# Altium schematic sheet 0204_PCH_MISC.SchDoc
size A3
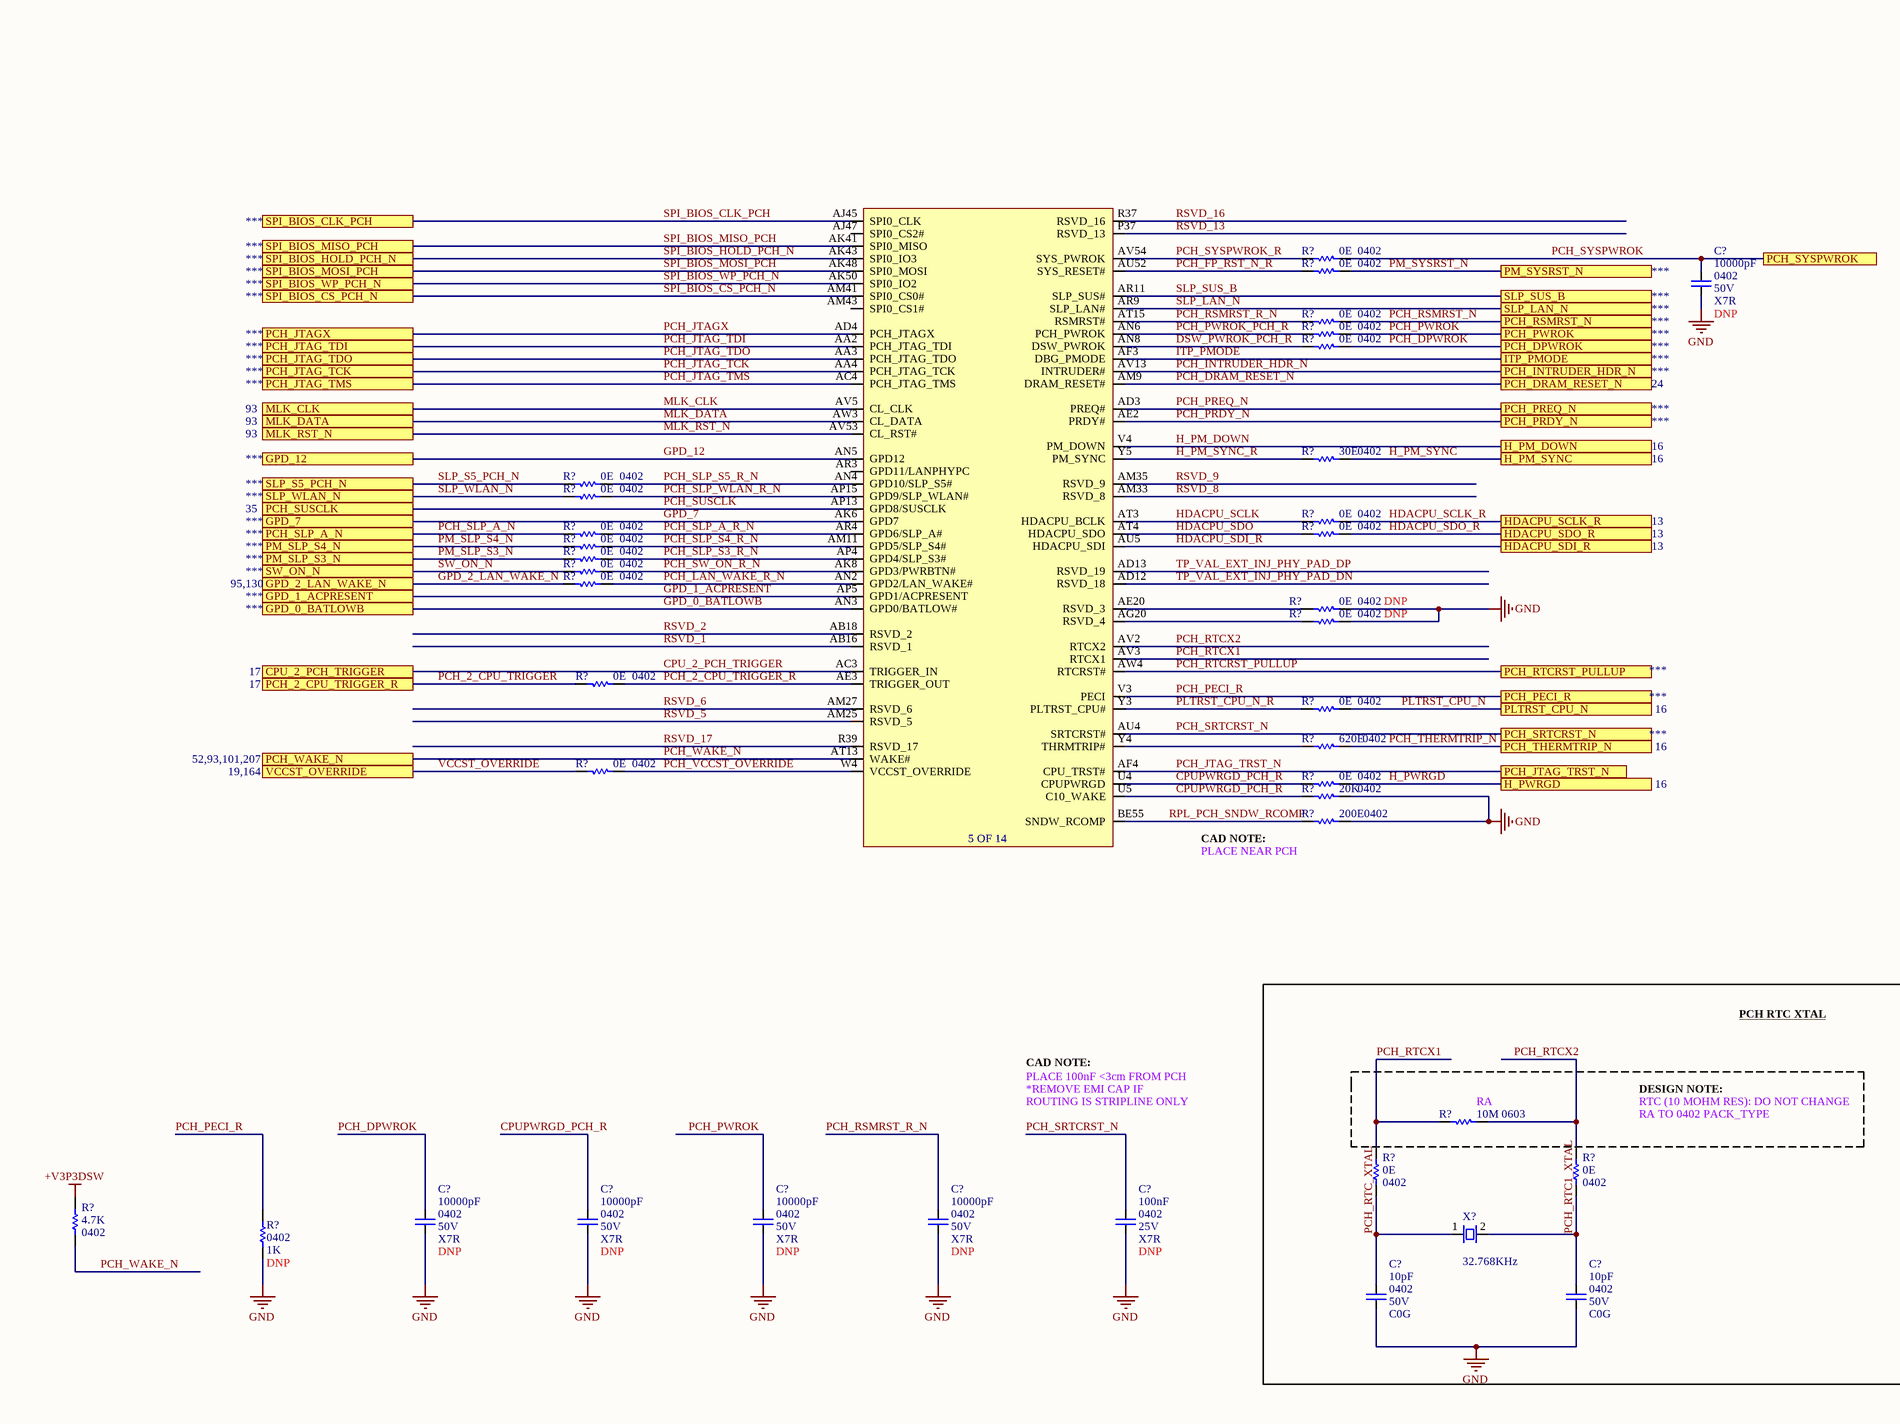
[diagram p0: 0204_PCH_MISC.SchDoc, left]
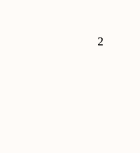
[diagram p1: 0204_PCH_MISC.SchDoc, right]

## Parts
(Parts that share a designator on the sheet are numbered #1, #2 ... from top to bottom, then left to right.)
C?#1  value 10000pF  Case/Package: 0402  Voltage: 50V  Dielectric: X7R  [CAPC0402]
C?#2  value 10000pF  Case/Package: 0402  Voltage: 50V  Dielectric: X7R  [CAPC0402]
C?#3  value 10000pF  Case/Package: 0402  Voltage: 50V  Dielectric: X7R  [CAPC0402]
C?#4  value 10000pF  Case/Package: 0402  Voltage: 50V  Dielectric: X7R  [CAPC0402]
C?#5  value 10000pF  Case/Package: 0402  Voltage: 50V  Dielectric: X7R  [CAPC0402]
C?#6  value 100nF  Case/Package: 0402  Voltage: 25V  Dielectric: X7R  [CAPC0402]
C?#7  value 10pF  Case/Package: 0402  Voltage: 50V  Dielectric: C0G  [CAPC0402]
C?#8  value 10pF  Case/Package: 0402  Voltage: 50V  Dielectric: C0G  [CAPC0402]
R?#1  value 0E  Case/Package: 0402  [RESC0402]  (hidden comment: Res)
R?#2  value 0E  Case/Package: 0402  [RESC0402]  (hidden comment: Res)
R?#3  value 0E  Case/Package: 0402  [RESC0402]  (hidden comment: Res)
R?#4  value 0E  Case/Package: 0402  [RESC0402]  (hidden comment: Res)
R?#5  value 0E  Case/Package: 0402  [RESC0402]  (hidden comment: Res)
R?#6  value 30E  Case/Package: 0402  [RESC0402]  (hidden comment: Res)
R?#7  value 0E  Case/Package: 0402  [RESC0402]  (hidden comment: Res)
R?#8  value 0E  Case/Package: 0402  [RESC0402]  (hidden comment: Res)
R?#9  value 0E  Case/Package: 0402  [RESC0402]  (hidden comment: Res)
R?#10  value 0E  Case/Package: 0402  [RESC0402]  (hidden comment: Res)
R?#11  value 0E  Case/Package: 0402  [RESC0402]  (hidden comment: Res)
R?#12  value 0E  Case/Package: 0402  [RESC0402]  (hidden comment: Res)
R?#13  value 0E  Case/Package: 0402  [RESC0402]  (hidden comment: Res)
R?#14  value 0E  Case/Package: 0402  [RESC0402]  (hidden comment: Res)
R?#15  value 0E  Case/Package: 0402  [RESC0402]  (hidden comment: Res)
R?#16  value 0E  Case/Package: 0402  [RESC0402]  (hidden comment: Res)
R?#17  value 0E  Case/Package: 0402  [RESC0402]  (hidden comment: Res)
R?#18  value 0E  Case/Package: 0402  [RESC0402]  (hidden comment: Res)
R?#19  value 0E  Case/Package: 0402  [RESC0402]  (hidden comment: Res)
R?#20  value 620E  Case/Package: 0402  [RESC0402]  (hidden comment: Res)
R?#21  value 0E  Case/Package: 0402  [RESC0402]  (hidden comment: Res)
R?#22  value 0E  Case/Package: 0402  [RESC0402]  (hidden comment: Res)
R?#23  value 20K  Case/Package: 0402  [RESC0402]  (hidden comment: Res)
R?#24  value 200E  Case/Package: 0402  [RESC0402]  (hidden comment: Res)
R?#25  value 10M  Case/Package: 0603  [RESC0603]  (hidden comment: Res)
R?#26  value 0E  Case/Package: 0402  [RESC0402]  (hidden comment: Res)
R?#27  value 0E  Case/Package: 0402  [RESC0402]  (hidden comment: Res)
R?#28  value 4.7K  Case/Package: 0402  [RESC0402]  (hidden comment: Res)
R?#29  value 1K  Case/Package: 0402  [RESC0402]  (hidden comment: Res)
U23601  C_RPL_S_PCH_EXT  (value not drawn)  (part E of 14)
X?  32.768KHz  [9HT1232768KDZFT]

## Ports
CPU_2_PCH_TRIGGER, GPD_0_BATLOWB, GPD_1_ACPRESENT, GPD_2_LAN_WAKE_N, GPD_7, GPD_12, H_PM_DOWN, H_PM_SYNC, H_PWRGD, HDACPU_SCLK_R, HDACPU_SDI_R, HDACPU_SDO_R, ITP_PMODE, MLK_CLK, MLK_DATA, MLK_RST_N, PCH_2_CPU_TRIGGER_R, PCH_DPWROK, PCH_DRAM_RESET_N, PCH_INTRUDER_HDR_N, PCH_JTAG_TCK, PCH_JTAG_TDI, PCH_JTAG_TDO, PCH_JTAG_TMS, PCH_JTAG_TRST_N, PCH_JTAGX, PCH_PECI_R, PCH_PRDY_N, PCH_PREQ_N, PCH_PWROK, PCH_RSMRST_N, PCH_RTCRST_PULLUP, PCH_SLP_A_N, PCH_SRTCRST_N, PCH_SUSCLK, PCH_SYSPWROK, PCH_THERMTRIP_N, PCH_WAKE_N, PLTRST_CPU_N, PM_SLP_S3_N, PM_SLP_S4_N, PM_SYSRST_N, SLP_LAN_N, SLP_S5_PCH_N, SLP_SUS_B, SLP_WLAN_N, SPI_BIOS_CLK_PCH, SPI_BIOS_CS_PCH_N, SPI_BIOS_HOLD_PCH_N, SPI_BIOS_MISO_PCH, SPI_BIOS_MOSI_PCH, SPI_BIOS_WP_PCH_N, SW_ON_N, VCCST_OVERRIDE

## Nets
+V3P3DSW: R?#28.2
GND: C?#1.2 C?#2.2 C?#3.2 C?#4.2 C?#5.2 C?#6.2 C?#7.2 C?#8.2 R?#16.2 R?#17.2 R?#23.2 R?#24.2 R?#29.1
CPU_2_PCH_TRIGGER: U23601.AC3(TRIGGER_IN) ; port CPU_2_PCH_TRIGGER
CPUPWRGD_PCH_R: C?#3.1 R?#22.1 R?#23.1 U23601.U4(CPUPWRGD) U23601.U5(C10_WAKE)
DSW_PWROK_PCH_R: R?#5.1 U23601.AN8(DSW_PWROK)
GPD_0_BATLOWB: U23601.AN3(GPD0/BATLOW#) ; port GPD_0_BATLOWB
GPD_1_ACPRESENT: U23601.AP5(GPD1/ACPRESENT) ; port GPD_1_ACPRESENT
GPD_2_LAN_WAKE_N: R?#15.1 ; port GPD_2_LAN_WAKE_N
GPD_7: U23601.AK6(GPD7) ; port GPD_7
GPD_12: U23601.AN5(GPD12) ; port GPD_12
H_PM_DOWN: U23601.V4(PM_DOWN) ; port H_PM_DOWN
H_PM_SYNC: R?#6.2 ; port H_PM_SYNC
H_PM_SYNC_R: R?#6.1 U23601.Y5(PM_SYNC)
H_PWRGD: R?#22.2 ; port H_PWRGD
HDACPU_SCLK: R?#9.1 U23601.AT3(HDACPU_BCLK)
HDACPU_SCLK_R: R?#9.2 ; port HDACPU_SCLK_R
HDACPU_SDI_R: U23601.AU5(HDACPU_SDI) ; port HDACPU_SDI_R
HDACPU_SDO: R?#11.1 U23601.AT4(HDACPU_SDO)
HDACPU_SDO_R: R?#11.2 ; port HDACPU_SDO_R
ITP_PMODE: U23601.AF3(DBG_PMODE) ; port ITP_PMODE
MLK_CLK: U23601.AV5(CL_CLK) ; port MLK_CLK
MLK_DATA: U23601.AW3(CL_DATA) ; port MLK_DATA
MLK_RST_N: U23601.AV53(CL_RST#) ; port MLK_RST_N
PCH_2_CPU_TRIGGER: R?#18.1 ; port PCH_2_CPU_TRIGGER_R
PCH_2_CPU_TRIGGER_R: R?#18.2 U23601.AE3(TRIGGER_OUT)
PCH_DPWROK: C?#2.1 R?#5.2 ; port PCH_DPWROK
PCH_DRAM_RESET_N: U23601.AM9(DRAM_RESET#) ; port PCH_DRAM_RESET_N
PCH_FP_RST_N_R: R?#2.1 U23601.AU52(SYS_RESET#)
PCH_INTRUDER_HDR_N: U23601.AV13(INTRUDER#) ; port PCH_INTRUDER_HDR_N
PCH_JTAG_TCK: U23601.AA4(PCH_JTAG_TCK) ; port PCH_JTAG_TCK
PCH_JTAG_TDI: U23601.AA2(PCH_JTAG_TDI) ; port PCH_JTAG_TDI
PCH_JTAG_TDO: U23601.AA3(PCH_JTAG_TDO) ; port PCH_JTAG_TDO
PCH_JTAG_TMS: U23601.AC4(PCH_JTAG_TMS) ; port PCH_JTAG_TMS
PCH_JTAG_TRST_N: U23601.AF4(CPU_TRST#) ; port PCH_JTAG_TRST_N
PCH_JTAGX: U23601.AD4(PCH_JTAGX) ; port PCH_JTAGX
PCH_LAN_WAKE_R_N: R?#15.2 U23601.AN2(GPD2/LAN_WAKE#)
PCH_PECI_R: R?#29.2 U23601.V3(PECI) ; port PCH_PECI_R
PCH_PRDY_N: U23601.AE2(PRDY#) ; port PCH_PRDY_N
PCH_PREQ_N: U23601.AD3(PREQ#) ; port PCH_PREQ_N
PCH_PWROK: C?#4.1 R?#4.2 ; port PCH_PWROK
PCH_PWROK_PCH_R: R?#4.1 U23601.AN6(PCH_PWROK)
PCH_RSMRST_N: R?#3.2 ; port PCH_RSMRST_N
PCH_RSMRST_R_N: C?#5.1 R?#3.1 U23601.AT15(RSMRST#)
PCH_RTC1_XTAL: C?#8.1 R?#27.1 X?.2(CRYSTAL_2)
PCH_RTC_XTAL: C?#7.1 R?#26.1 X?.1(CRYSTAL_1)
PCH_RTCRST_PULLUP: U23601.AW4(RTCRST#) ; port PCH_RTCRST_PULLUP
PCH_RTCX1: R?#25.1 R?#26.2 U23601.AV3(RTCX1)
PCH_RTCX2: R?#25.2 R?#27.2 U23601.AV2(RTCX2)
PCH_SLP_A_N: R?#10.1 ; port PCH_SLP_A_N
PCH_SLP_A_R_N: R?#10.2 U23601.AR4(GPD6/SLP_A#)
PCH_SLP_S3_R_N: R?#13.2 U23601.AP4(GPD4/SLP_S3#)
PCH_SLP_S4_R_N: R?#12.2 U23601.AM11(GPD5/SLP_S4#)
PCH_SLP_S5_R_N: R?#7.2 U23601.AN4(GPD10/SLP_S5#)
PCH_SLP_WLAN_R_N: R?#8.2 U23601.AP15(GPD9/SLP_WLAN#)
PCH_SRTCRST_N: C?#6.1 U23601.AU4(SRTCRST#) ; port PCH_SRTCRST_N
PCH_SUSCLK: U23601.AP13(GPD8/SUSCLK) ; port PCH_SUSCLK
PCH_SW_ON_R_N: R?#14.2 U23601.AK8(GPD3/PWRBTN#)
PCH_SYSPWROK: C?#1.1 R?#1.2 ; port PCH_SYSPWROK
PCH_SYSPWROK_R: R?#1.1 U23601.AV54(SYS_PWROK)
PCH_THERMTRIP_N: R?#20.2 ; port PCH_THERMTRIP_N
PCH_VCCST_OVERRIDE: R?#21.2 U23601.W4(VCCST_OVERRIDE)
PCH_WAKE_N: R?#28.1 U23601.AT13(WAKE#) ; port PCH_WAKE_N
PLTRST_CPU_N: R?#19.2 ; port PLTRST_CPU_N
PLTRST_CPU_N_R: R?#19.1 U23601.Y3(PLTRST_CPU#)
PM_SLP_S3_N: R?#13.1 ; port PM_SLP_S3_N
PM_SLP_S4_N: R?#12.1 ; port PM_SLP_S4_N
PM_SYSRST_N: R?#2.2 ; port PM_SYSRST_N
RPL_PCH_SNDW_RCOMP: R?#24.1 U23601.BE55(SNDW_RCOMP)
RSVD_1: U23601.AB16(RSVD_1)
RSVD_2: U23601.AB18(RSVD_2)
RSVD_5: U23601.AM25(RSVD_5)
RSVD_6: U23601.AM27(RSVD_6)
RSVD_8: U23601.AM33(RSVD_8)
RSVD_9: U23601.AM35(RSVD_9)
RSVD_13: U23601.P37(RSVD_13)
RSVD_16: U23601.R37(RSVD_16)
RSVD_17: U23601.R39(RSVD_17)
SLP_LAN_N: U23601.AR9(SLP_LAN#) ; port SLP_LAN_N
SLP_S5_PCH_N: R?#7.1 ; port SLP_S5_PCH_N
SLP_SUS_B: U23601.AR11(SLP_SUS#) ; port SLP_SUS_B
SLP_WLAN_N: R?#8.1 ; port SLP_WLAN_N
SPI_BIOS_CLK_PCH: U23601.AJ45(SPI0_CLK) ; port SPI_BIOS_CLK_PCH
SPI_BIOS_CS_PCH_N: U23601.AM41(SPI0_CS0#) ; port SPI_BIOS_CS_PCH_N
SPI_BIOS_HOLD_PCH_N: U23601.AK43(SPI0_IO3) ; port SPI_BIOS_HOLD_PCH_N
SPI_BIOS_MISO_PCH: U23601.AK41(SPI0_MISO) ; port SPI_BIOS_MISO_PCH
SPI_BIOS_MOSI_PCH: U23601.AK48(SPI0_MOSI) ; port SPI_BIOS_MOSI_PCH
SPI_BIOS_WP_PCH_N: U23601.AK50(SPI0_IO2) ; port SPI_BIOS_WP_PCH_N
SW_ON_N: R?#14.1 ; port SW_ON_N
TP_VAL_EXT_INJ_PHY_PAD_DN: U23601.AD12(RSVD_18)
TP_VAL_EXT_INJ_PHY_PAD_DP: U23601.AD13(RSVD_19)
VCCST_OVERRIDE: R?#21.1 ; port VCCST_OVERRIDE
NetR?#16_1: R?#16.1 U23601.AE20(RSVD_3)
NetR?#17_1: R?#17.1 U23601.AG20(RSVD_4)
NetR?#20_1: R?#20.1 U23601.Y4(THRMTRIP#)

Not connected (* = marked no-connect by the designer): U23601 AJ47(SPI0_CS2#) AM43(SPI0_CS1#) AR3(GPD11/LANPHYPC)

## Notes on the sheet
- 2
- CAD NOTE:
- (near R?#24) PLACE NEAR PCH
- PCH RTC XTAL
- PLACE 100nF <3cm FROM PCH
- *REMOVE EMI CAP IF
- DESIGN NOTE:
- ROUTING IS STRIPLINE ONLY
- (near R?#25) RA
- RA TO 0402 PACK_TYPE
- RTC (10 MOHM RES): DO NOT CHANGE
- (in symbol C_RPL_S_PCH_EXT, part E) 5 OF 14

## Library data of the parts
C?#1-C?#5 = Cap: CAP CER 10000pF 50V X7R 0402; DNP: DNP
C?#6 = Cap: CAP CER 100nF 25V X7R 0402; DNP: DNP
C?#7 C?#8 = Cap: CAP CER 10pF 50V C0G 0402
R?#1-R?#5 R?#7 R?#8 R?#10-R?#19 R?#21 R?#22 R?#26 R?#27 = Res: Thick Film Resistor -  0ohm, 1%, 0402
  R?#16 R?#17: DNP: DNP
R?#6 = Res: Thick Film Resistor -  30ohm, 1%, 0402
R?#9 = Res: Thick Film Resistor - 0ohm, 1%, 0402
R?#20 = Res: Thick Film Resistor - 620ohm, 1%, 0402
R?#23 = Res: Thick Film Resistor -  20K, 1%, 0402
R?#24 = Res: Thick Film Resistor - 200ohm, 1%, 0402
R?#25 = Res: Thick Film Resistor -  10M, 1%, 0603
R?#28 = Res: Thick Film Resistor -  4.7Kohm, 1%, 0402
R?#29 = Res: Thick Film Resistor -  1Kohm, 1%, 0402; DNP: DNP
X? = Crystal 32.768K DZF-T: Crystals 32.768KHz 20ppm 12.5pF; Manufacturer_Part_Number: 9HT12-32.768KDZF-T; Value: 32.768KHz; Case/Package: SMD/SMT
U23601 = C_RPL_S_PCH_EXT: Manufacturer Part Number: *; Case/Package: *